# Altium project PCB_TH(IMPORTANT).PrjPcb
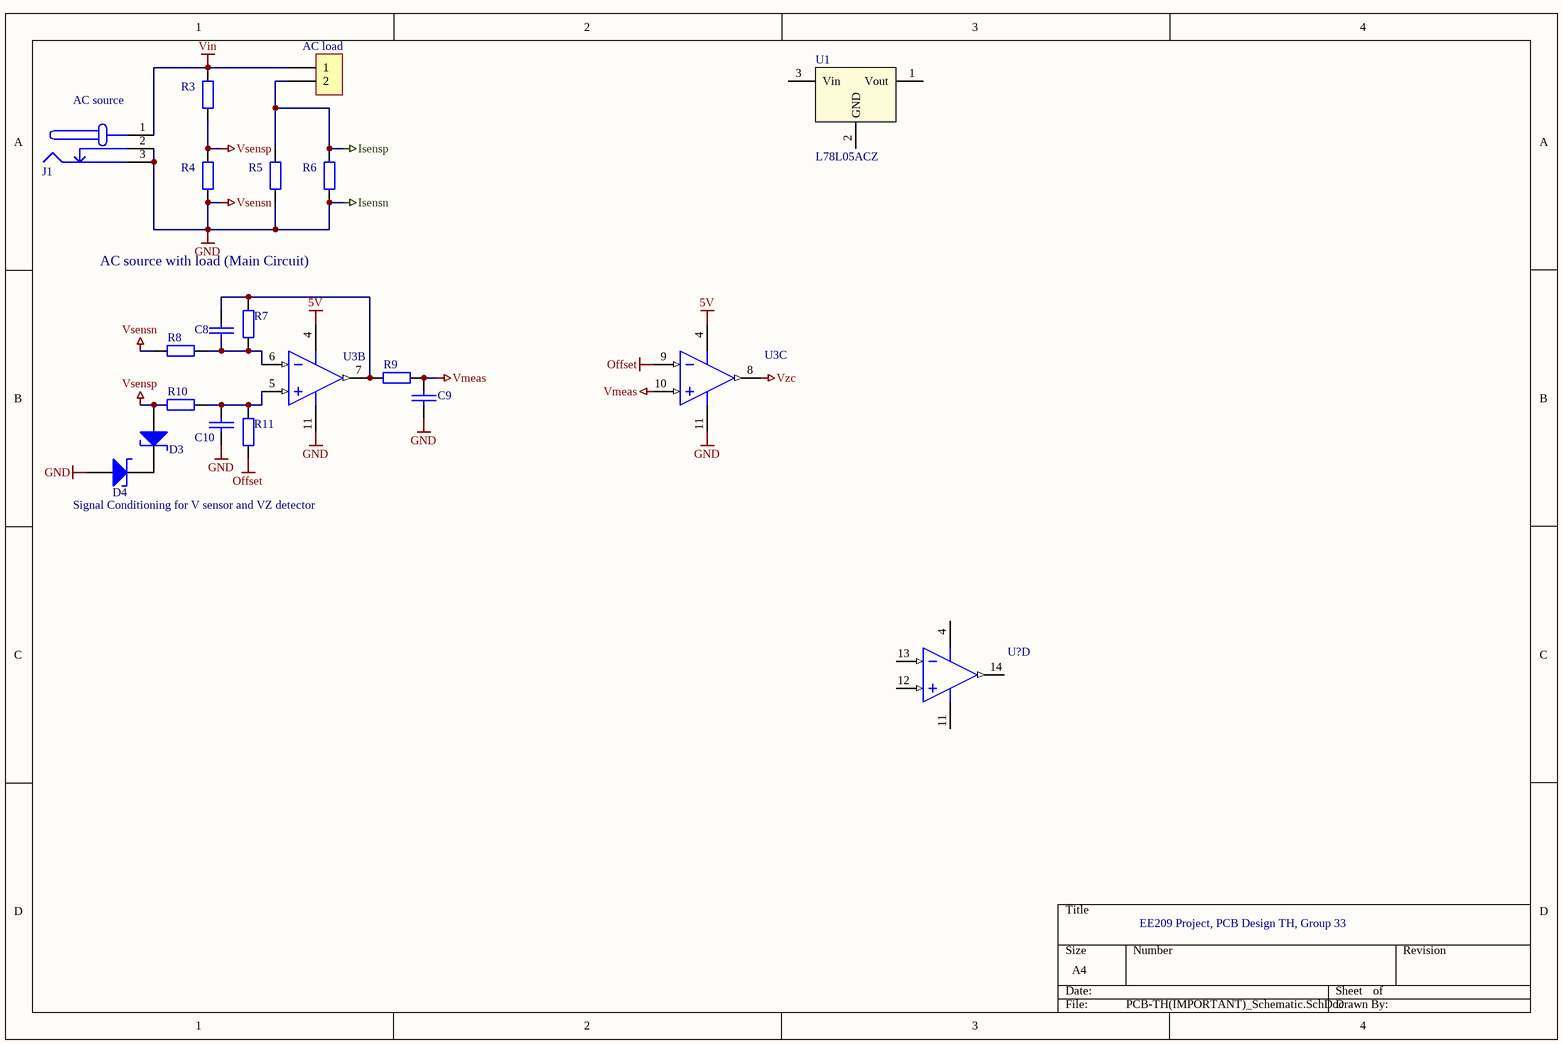
[diagram p0: PCB-TH(IMPORTANT)_Schematic.SchDoc]
1 sheet, 19 parts. Net scope: global (net labels, ports and power ports of the same name join across sheets).
Board file: PCB_TH(IMPORTANT)_PCB.PcbDoc

## Sheet PCB-TH(IMPORTANT)_Schematic.SchDoc
size A4; SheetNumber: 1; SheetTotal: 1

### Parts
?  Dual Banana Plugs  [Dual Banana Plug]  (value not drawn)
C8  16n  [CCAP-5P0]  (value not drawn)
C9  16n  [CCAP-5P0]  (value not drawn)
C10  16n  [CCAP-5P0]  (value not drawn)
D3  BZX79-CXVX  [AXIAL-Zener-0.4]  (value not drawn)
D4  BZX79-CXVX  [AXIAL-Zener-0.4]  (value not drawn)
J1  DC barrel jack  [AC-Socket]  (value not drawn)
R3  22k  [AXIAL-0.4]  (value not drawn)
R4  1k  [AXIAL-0.4]  (value not drawn)
R5  1  [AXIAL-0.4]  (value not drawn)
R6  1.2  [AXIAL-0.4]  (value not drawn)
R7  100k  [AXIAL-0.4]  (value not drawn)
R8  100k  [AXIAL-0.4]  (value not drawn)
R9  1k  [AXIAL-0.4]  (value not drawn)
R10  100k  [AXIAL-0.4]  (value not drawn)
R11  100k  [AXIAL-0.4]  (value not drawn)
U1  L78L05ACZ  [TO-92]
U3  LM324  [DIP-14]  (value not drawn)  (parts B,C of 4)
U?  LM324  [DIP-14]  (value not drawn)  (part D of 4)

### Nets
5V: U3.4(VDD)
GND: C9.2 C10.2 D4.1(A) J1.2(GND_ALT) J1.3(GND) R4.1 R5.1 R6.1 R8.1 U3.11(VSS)  [also labelled Isensn, Vsensn]
Isensp: ?.2 R5.2 R6.2
Offset: R11.1 U3.9(VINC-)
Vin: ?.1 J1.1(VCC) R3.1
Vmeas: C9.1 R9.2 U3.10(VINC+)
Vsensp: D3.1(A) R3.2 R4.2 R10.1
Vzc: U3.8(VOUTC)
NetC8_1: C8.1 R7.2 R9.1 U3.7(VOUTB)
NetC8_2: C8.2 R7.1 R8.2 U3.6(VINB-)
NetC10_1: C10.1 R10.2 R11.2 U3.5(VINB+)
NetD3_2: D3.2(K) D4.2(K)

Not connected (* = marked no-connect by the designer): U1 1(Vout) 2(GND) 3(Vin); U? 4(VDD) 11(VSS) 12(VIND+) 13(VIND-) 14(VOUTD)

### Notes on the sheet
- AC load
- (near J1) AC source
- AC source with load (Main Circuit)
- (near D4) Signal Conditioning for V sensor and VZ detector
- EE209 Project, PCB Design TH, Group 33

### Library data of the parts
? = AC_Output: Dual banana plugs connection to the AC load; LatestRevisionDate: 17-Jul-2002; LatestRevisionNote: Re-released for DXP Platform.; Publisher: Altium Limited
C8-C10 = CerCap_TH_5P0: TH ceramic capacitor with 5mm pitch; Value: 16n
D3 D4 = Zener_TH_4AX0: Axial zener diode BZX79 series; Manufacturer: Nexperia USA Inc.; Manufacturer Part Number: BZX79-C4V7,143; Tolerance: ±5%; Supplier 1: Digi-Key; RoHS: RoHS Compliant; Category: Discrete Semiconductor Products; Stock 1: 8933; Pricing 1: 1=0.23, 10=0.206, 100=0.1123, 500=0.06912, 1000=0.04714 (NZD); Packaging: Cut Tape (CT); Part Status: Active; Operating Temperature: -65°C ~ 200°C; Mounting Type: Through Hole; Package / Case: DO-204AH, DO-35, Axial; Supplier Device Package: DO-35; ComponentLink1URL: https://assets.nexperia.com/documents/data-sheet/BZX79.pdf; ComponentLink1Description: https://assets.nexperia.com/documents/data-sheet/BZX79.pdf; Supplier Part Number 1: 1727-1864-1-ND
J1 = AC_Input: DC barrel jack connection to AC source; Value: socket
R3-R11 = Res_TH_0AX4: Through hole resistor; Published: 8-Jun-2000; LatestRevisionDate: 17-Jul-2002; LatestRevisionNote: Re-released for DXP Platform.; PackageReference: AXIAL-0.4; Publisher: Altium Limited; ComponentLink1Description: http://www.royalohm.com/pdf/product2017/PrecisionMetalMF.pdf
  R3: Value: 22k
  R4 R9: Value: 1k
  R5: Value: 1
  R6: Value: 1.2
  R7 R8 R10 R11: Value: 100k
U1 = L78L05_TH_TO92: Voltage Regulator 5V; Manufacturer: ON Semiconductor; Manufacturer Part Number: LM78L05ACZX; Output Configuration: Positive; Output Type: Fixed; Voltage - Input (Max): 30V; Current - Output: 100mA; PSRR: 80dB (120Hz); Protection Features: Over Temperature, Short Circuit; Supplier 1: Digi-Key; RoHS: RoHS Compliant; Category: Integrated Circuits (ICs); Stock 1: 7782; Pricing 1: 1=0.69, 10=0.517, 100=0.3226, 500=0.2207, 1000=0.16976 (NZD); Packaging: Cut Tape (CT); Part Status: Active; Voltage - Output (Min/Fixed): 5V; Voltage - Output (Max): -; Voltage Dropout (Max): -; Control Features: -; Operating Temperature: -40°C ~ 125°C; Mounting Type: Through Hole; Package / Case: TO-226-3, TO-92-3 (TO-226AA) (Formed Leads); Supplier Device Package: TO-92-3; Base Part Number: LM78L05; ComponentLink1URL: https://www.fairchildsemi.com/datasheets/MC/MC78L05A.pdf; ComponentLink1Description: https://www.fairchildsemi.com/datasheets/MC/MC78L05A.pdf; Supplier Part Number 1: LM78L05ACZXCT-ND
U3 U? = LM324N_TH_DIP16: IC OPAMP GP 14DIP; Manufacturer: ON Semiconductor; Manufacturer Part Number: LM324N; Amplifier Type: General Purpose; Current - Supply: 1mA; Voltage - Supply, Single/Dual (±): 3 V ~ 32 V, ±1.5 V ~ 16 V; Supplier 1: Digi-Key; RoHS: RoHS Compliant; Category: Integrated Circuits (ICs); Stock 1: 2900; Pricing 1: 1=0.9, 10=0.775, 100=0.5789, 500=0.45482, 1000=0.35145 (NZD); Packaging: Tube; Part Status: Active; Output Type: -; Slew Rate: -; Operating Temperature: 0°C ~ 70°C; Mounting Type: Through Hole; Package / Case: 14-DIP (0.300", 7.62mm); Supplier Device Package: 14-DIP; Base Part Number: LM324; ComponentLink1URL: https://www.fairchildsemi.com/datasheets/LM/LM2902.pdf; ComponentLink1Description: https://www.fairchildsemi.com/datasheets/LM/LM2902.pdf; Supplier Part Number 1: LM324NFS-ND